# EAGLE design Adafruit HaD Proto HAT rev A (EAGLE 7.6.0)
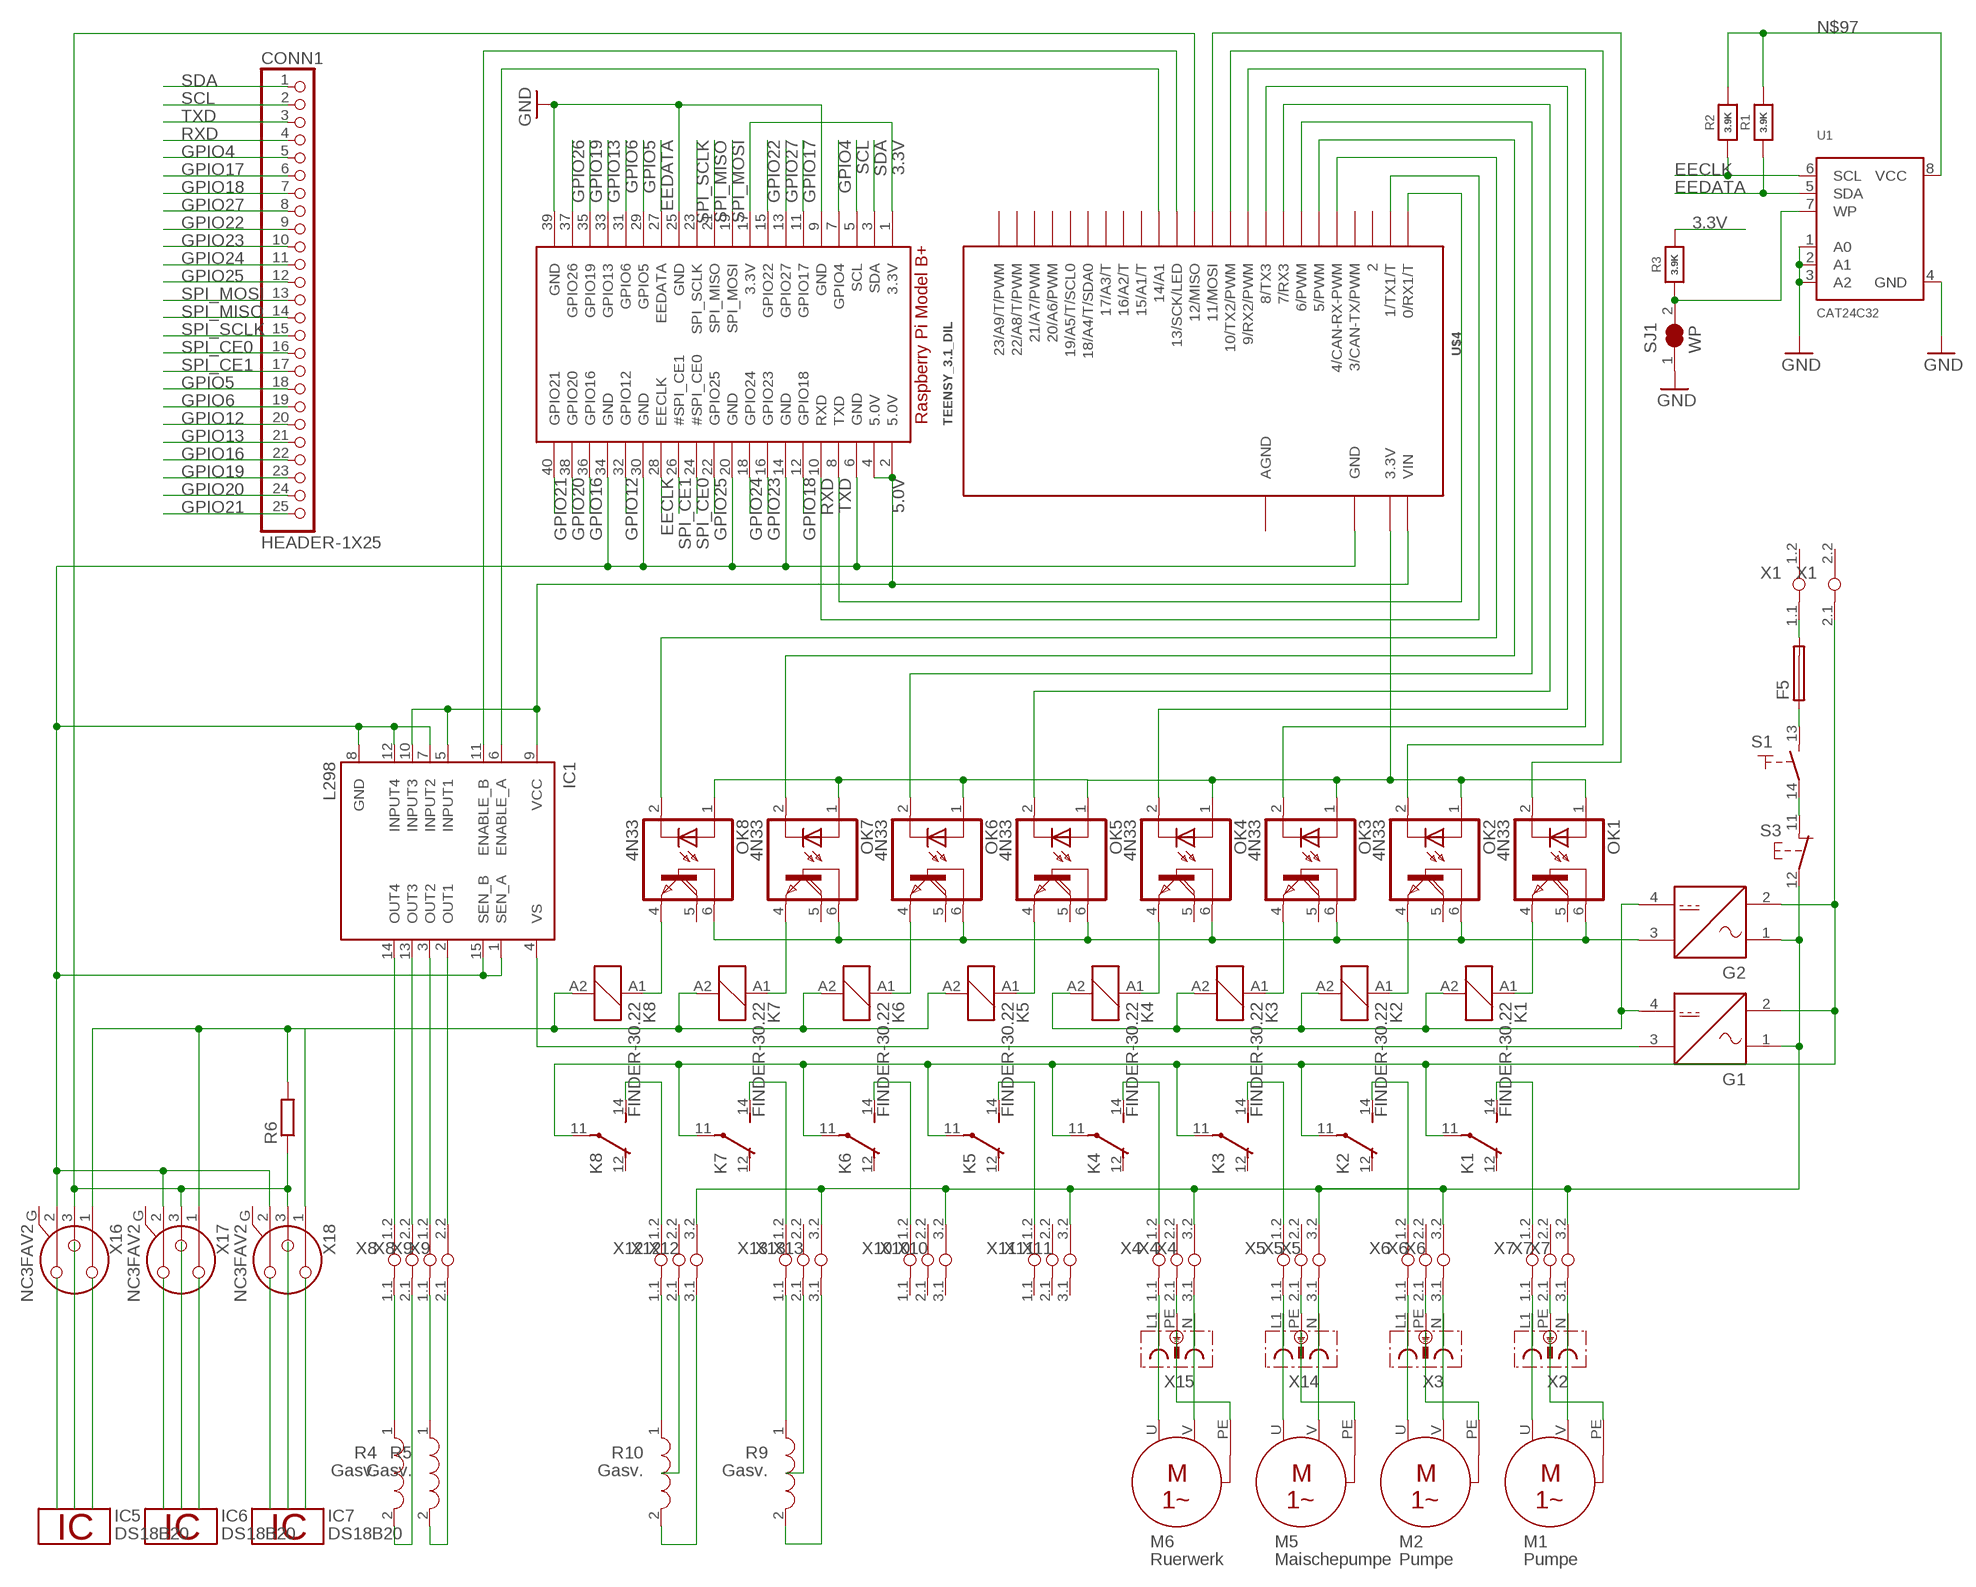
[diagram p0: schematic, sheet 1]

## Parts
CONN1  HEADER-1X25  [1X25_ROUND_70MIL]
F5  KS9V  [KS9V]
G1  NETZTEIL_GLEICHSPANNUNG  [NETZTEIL_GLEICHSPANNUNG]
G2  NETZTEIL_GLEICHSPANNUNG  [NETZTEIL_GLEICHSPANNUNG]
IC1  L298  [MULTIWATT-15]
IC5  DS18B20  [TO92-]
IC6  DS18B20  [TO92-]
IC7  DS18B20  [TO92-]
K1  FINDER-30.22  [FINDER-30.22]
K2  FINDER-30.22  [FINDER-30.22]
K3  FINDER-30.22  [FINDER-30.22]
K4  FINDER-30.22  [FINDER-30.22]
K5  FINDER-30.22  [FINDER-30.22]
K6  FINDER-30.22  [FINDER-30.22]
K7  FINDER-30.22  [FINDER-30.22]
K8  FINDER-30.22  [FINDER-30.22]
M1  Pumpe  MOTOR_1-PHASEN  [MOTOR_1-PHASEN]
M2  Pumpe  MOTOR_1-PHASEN  [MOTOR_1-PHASEN]
M5  Maischepumpe  MOTOR_1-PHASEN  [MOTOR_1-PHASEN]
M6  Ruerwerk  MOTOR_1-PHASEN  [MOTOR_1-PHASEN]
OK1  4N33  [DIL06]
OK2  4N33  [DIL06]
OK3  4N33  [DIL06]
OK4  4N33  [DIL06]
OK5  4N33  [DIL06]
OK6  4N33  [DIL06]
OK7  4N33  [DIL06]
OK8  4N33  [DIL06]
R1  3.9K  RESISTOR0805_NOOUTLINE  [0805-NO]
R2  3.9K  RESISTOR0805_NOOUTLINE  [0805-NO]
R3  3.9K  RESISTOR0805_NOOUTLINE  [0805-NO]
R4  Gasv.  SPULE_ALTERNATIV  [SPULE]
R5  Gasv.  SPULE_ALTERNATIV  [SPULE]
R6  R-EU_0204/2V  [0204V]
R9  Gasv.  SPULE_ALTERNATIV  [SPULE]
R10  Gasv.  SPULE_ALTERNATIV  [SPULE]
RPI1  RASPBERRYPI_BPLUS_HATNOSLOTS  [PI_HAT_NOSLOTS]
S1  SCHLIESSER_KIPPSCHALTER  [SCHLIESSER_KIPPSCHALTER]
S3  TASTER_OEFFNER  [AUSTASTER]
SJ1  WP  SOLDERJUMPER_CLOSED  [SOLDERJUMPER_CLOSEDWIRE]
U1  CAT24C32  EEPROM_I2C_SOIC8_GENERIC  [SOIC8_150MIL]
U$4  TEENSY_3.1_DIL  [TEENSY3-DIL]
X1  KLEMME_1-2  [KLEMME_1-2]
X2  STECKDOSE  [STECKDOSE]
X3  STECKDOSE  [STECKDOSE]
X4  KLEMME_1-3  [KLEMME_1-3]
X5  KLEMME_1-3  [KLEMME_1-3]
X6  KLEMME_1-3  [KLEMME_1-3]
X7  KLEMME_1-3  [KLEMME_1-3]
X8  KLEMME_1-2  [KLEMME_1-2]
X9  KLEMME_1-2  [KLEMME_1-2]
X10  KLEMME_1-3  [KLEMME_1-3]
X11  KLEMME_1-3  [KLEMME_1-3]
X12  KLEMME_1-3  [KLEMME_1-3]
X13  KLEMME_1-3  [KLEMME_1-3]
X14  STECKDOSE  [STECKDOSE]
X15  STECKDOSE  [STECKDOSE]
X16  NC3FAV2  [NC3FAV2]
X17  NC3FAV2  [NC3FAV2]
X18  NC3FAV2  [NC3FAV2]

## Nets
3.3V: R3.2 RPI1.1(3.3V) RPI1.17(3.3V)
5.0V: IC1.5(INPUT1) IC1.9(VCC) IC1.10(INPUT3) RPI1.2(5.0V) RPI1.4(5.0V) U$4.VIN
EECLK: R2.1 RPI1.28(EECLK) U1.6(SCL)
EEDATA: R1.1 RPI1.27(EEDATA) U1.5(SDA)
GND: IC1.1(SEN_A) IC1.7(INPUT2) IC1.8(GND) IC1.12(INPUT4) IC1.15(SEN_B) RPI1.6(GND) RPI1.9(GND) RPI1.14(GND) RPI1.20(GND) RPI1.25(GND) RPI1.30(GND) RPI1.34(GND) RPI1.39(GND) SJ1.1 U1.1(A0) U1.2(A1) U1.3(A2) U1.4(GND) U$4.GND X16.2 X17.2 X18.2
GPIO4: CONN1.5 RPI1.7(GPIO4)
GPIO5: CONN1.18 RPI1.29(GPIO5)
GPIO6: CONN1.19 RPI1.31(GPIO6)
GPIO12: CONN1.20 RPI1.32(GPIO12)
GPIO13: CONN1.21 RPI1.33(GPIO13)
GPIO16: CONN1.22 RPI1.36(GPIO16)
GPIO17: CONN1.6 RPI1.11(GPIO17)
GPIO18: CONN1.7 RPI1.12(GPIO18)
GPIO19: CONN1.23 RPI1.35(GPIO19)
GPIO20: CONN1.24 RPI1.38(GPIO20)
GPIO21: CONN1.25 RPI1.40(GPIO21)
GPIO22: CONN1.9 RPI1.15(GPIO22)
GPIO23: CONN1.10 RPI1.16(GPIO23)
GPIO24: CONN1.11 RPI1.18(GPIO24)
GPIO25: CONN1.12 RPI1.22(GPIO25)
GPIO26: RPI1.37(GPIO26)
GPIO27: CONN1.8 RPI1.13(GPIO27)
N$16: R3.1 SJ1.2 U1.7(WP)
N$24: IC1.11(ENABLE_B) U$4.13(13/SCK/LED)
N$25: IC1.6(ENABLE_A) U$4.14/A0(14/A1)
N$26: IC1.14(OUT4) X8.1.2(1:1.2)
N$27: G1.3 IC1.4(VS)
N$28: G1.1 G1.2 G2.1 G2.2 S3.12 X1.2.1(2:2.1) X4.3.2(3:3.2) X5.3.2(3:3.2) X6.3.2(3:3.2) X7.3.2(3:3.2) X10.3.2(3:3.2) X11.3.2(3:3.2) X12.3.2(3:3.2) X13.3.2(3:3.2)
N$29: R4.2 X8.2.1(2:2.1)
N$30: IC1.3(OUT2) X9.1.2(1:1.2)
N$31: IC1.2(OUT1) X9.2.2(2:2.2)
N$32: IC1.13(OUT3) X8.2.2(2:2.2)
N$33: OK4.2(C) U$4.8(8/TX3)
N$34: OK3.2(C) U$4.9(9/RX2/PWM)
N$35: OK2.2(C) U$4.10(10/TX2/PWM)
N$36: OK1.2(C) U$4.11(11/MOSI)
N$37: G2.3 OK1.6(B) OK2.6(B) OK3.6(B) OK4.6(B) OK5.6(B) OK6.6(B) OK7.6(B) OK8.6(B)
N$38: K1.A1 OK1.4(E)
N$40: K2.A1 OK2.4(E)
N$63: K3.A1 OK3.4(E)
N$64: K4.A1 OK4.4(E)
N$65: M1.U X2.L1 X7.1.1(1:1.1)
N$66: M2.U X3.L1 X6.1.1(1:1.1)
N$67: K3.14(-1:S) X5.1.2(1:1.2)
N$68: K4.14(-1:S) X4.1.2(1:1.2)
N$69: M5.U X5.1.1(1:1.1) X14.L1
N$70: M1.PE
N$71: M2.PE
N$72: M6.U X4.1.1(1:1.1) X15.L1
N$73: M5.PE
N$74: M6.PE
N$75: K2.14(-1:S) X6.1.2(1:1.2)
N$76: M2.V X3.N X6.3.1(3:3.1)
N$77: K1.14(-1:S) X7.1.2(1:1.2)
N$78: M1.V X2.N X7.3.1(3:3.1)
N$79: X3.PE X6.2.1(2:2.1)
N$80: X2.PE X7.2.1(2:2.1)
N$81: M6.V X4.3.1(3:3.1) X15.N
N$82: M5.V X5.3.1(3:3.1) X14.N
N$83: K1.11(-1:P)
N$84: K2.11(-1:P)
N$85: K3.11(-1:P)
N$86: K4.11(-1:P)
N$87: R4.1 X8.1.1(1:1.1)
N$88: F5.2 X1.1.1(1:1.1)
N$89: F5.1 S1.13
N$90: S1.14 S3.11
N$91: R6.1 U$4.12(12/MISO) X16.3 X17.3 X18.3
N$92: G1.4 G2.4 K1.A2 K2.A2 K3.A2 K4.A2
N$93: OK8.2(C) U$4.4(4/CAN-RX-PWM)
N$94: OK7.2(C) U$4.5(5/PWM)
N$95: OK6.2(C) U$4.6(6/PWM)
N$96: OK5.2(C) U$4.7(7/RX3)
N$97: R1.2 R2.2 U1.8(VCC)
N$98: K5.A1 OK5.4(E)
N$99: K6.A1 OK6.4(E)
N$100: K7.A1 OK7.4(E)
N$101: K8.A1 OK8.4(E)
N$102: R5.1 X9.1.1(1:1.1)
N$103: R5.2 X9.2.1(2:2.1)
N$104: K7.14(-1:S) X13.1.2(1:1.2)
N$105: K8.14(-1:S) X12.1.2(1:1.2)
N$106: K5.A2 K6.A2 K7.A2 K8.A2 R6.2 X16.1 X17.1 X18.1
N$108: R9.1 X13.1.1(1:1.1)
N$109: R9.2 X13.3.1(3:3.1)
N$110: R10.2 X12.3.1(3:3.1)
N$111: R10.1 X12.1.1(1:1.1)
N$112: K6.14(-1:S) X10.1.2(1:1.2)
N$114: K5.14(-1:S) X11.1.2(1:1.2)
N$118: X13.2.1(2:2.1)
N$119: X12.2.1(2:2.1)
N$120: K5.11(-1:P)
N$121: K6.11(-1:P)
N$122: K7.11(-1:P)
N$123: K8.11(-1:P)
N$125: X4.2.1(2:2.1) X15.PE
N$126: X5.2.1(2:2.1) X14.PE
N$132: OK1.1(A) OK2.1(A) OK3.1(A) OK4.1(A) OK5.1(A) OK6.1(A) OK7.1(A) OK8.1(A) U$4.3.3V
RXD: CONN1.4 RPI1.10(RXD) U$4.1(1/TX1/T)
SCL: CONN1.2 RPI1.5(SCL)
SDA: CONN1.1 RPI1.3(SDA)
SPI_CE0: CONN1.16 RPI1.24(#SPI_CE0)
SPI_CE1: CONN1.17 RPI1.26(#SPI_CE1)
SPI_MISO: CONN1.14 RPI1.21(SPI_MISO)
SPI_MOSI: CONN1.13 RPI1.19(SPI_MOSI)
SPI_SCLK: CONN1.15 RPI1.23(SPI_SCLK)
TXD: CONN1.3 RPI1.8(TXD) U$4.0(0/RX1/T)
Unconnected: K1.12(-1:O) K1.21(-2:P) K1.22(-2:O) K1.24(-2:S) K2.12(-1:O) K2.21(-2:P) K2.22(-2:O) K2.24(-2:S) K3.12(-1:O) K3.21(-2:P) K3.22(-2:O) K3.24(-2:S) K4.12(-1:O) K4.21(-2:P) K4.22(-2:O) K4.24(-2:S) K5.12(-1:O) K5.21(-2:P) K5.22(-2:O) K5.24(-2:S) K6.12(-1:O) K6.21(-2:P) K6.22(-2:O) K6.24(-2:S) K7.12(-1:O) K7.21(-2:P) K7.22(-2:O) K7.24(-2:S) K8.12(-1:O) K8.21(-2:P) K8.22(-2:O) K8.24(-2:S) OK1.5(COL) OK2.5(COL) OK3.5(COL) OK4.5(COL) OK5.5(COL) OK6.5(COL) OK7.5(COL) OK8.5(COL) U$4.2 U$4.3(3/CAN-TX/PWM) U$4.15/A1(15/A1/T) U$4.16/A2(16/A2/T) U$4.17/A3(17/A3/T) U$4.18/A4(18/A4/T/SDA0) U$4.19/A5(19/A5/T/SCL0) U$4.20/A6(20/A6/PWM) U$4.21/A7(21/A7/PWM) U$4.22/A8(22/A8/T/PWM) U$4.23/A9(23/A9/T/PWM) X1.1.2(1:1.2) X1.2.2(2:2.2) X4.2.2(2:2.2) X5.2.2(2:2.2) X6.2.2(2:2.2) X7.2.2(2:2.2) X10.1.1(1:1.1) X10.2.1(2:2.1) X10.2.2(2:2.2) X10.3.1(3:3.1) X11.1.1(1:1.1) X11.2.1(2:2.1) X11.2.2(2:2.2) X11.3.1(3:3.1) X12.2.2(2:2.2) X13.2.2(2:2.2) X16.G X17.G X18.G

## Power pins joined to a net without a drawn wire
1W: IC5.2 IC6.2 IC7.2
AGND: U$4.AGND
GND: IC5.1 IC6.1 IC7.1
VDD: IC5.3 IC6.3 IC7.3

## Library data of the parts
CONN1 = microbuilder:HEADER-1X25
F5 = fuse:KS9V: FUSE HOLDER CS, Schukat; OC_FARNELL: unknown; OC_NEWARK: unknown
G1 G2 = e-stromversorgungselemente:NETZTEIL_GLEICHSPANNUNG: Netzteil, Gleichspannung
IC1 = st-microelectronics:L298: DUAL FULL-BRIDGE DRIVER; MPN: L298N; OC_FARNELL: 1589425; OC_NEWARK: 32M1527
IC5-IC7 = 1wire:DS18B20: Programmable Resolution Digital Thermometer This chip provides a onewire thermosensor with approx. 0.5°C accuracy. A programmable over/undertemperure alarm is available. The precision can be set from 9..12 bits. Notes: Vdd must be applied for accurate measurements at low temperatures, as the parasite power circuit otherwise heats the sensor. If parasite power is used, Vdd has to be connected to GND. The DS1822 is a low-cost thermometer chip, the DS18S20 is similar to the DS18B20, but with 9 Bit precision only. Author: Jan Kandziora <jjj@gmx.de>
K1-K8 = relay:FINDER-30.22: SUBMINIATURE DIL-RELAIS FINDER 30.22.9.024.0000 Kontakt max. AC - 125V Distributor: Farnell Bestell Nr.: 1217371 Source: http://www.farnell.com/datasheets/87634.pdf; OC_FARNELL: unknown; OC_NEWARK: unknown
M1 M2 M5 M6 = e-motoren:MOTOR_1-PHASEN: 1-Phasen-Wechselstrom-Motor
OK1-OK8 = optocoupler:4N33: MOTOROLA OPTO COUPLER; MF: VISHAY/TELEFUNKEN; MPN: 4N33; OC_FARNELL: 1469601; OC_NEWARK: 88K1390
R1-R3 = microbuilder:RESISTOR: Resistors For new designs, use the packages preceded by an '_' character since they are more reliable: The following footprints should be used on most boards: _0402 - Standard footprint for regular board layouts _0603 - Standard footprint for regular board layouts _0805 - Standard footprint for regular board layouts _1206 - Standard footprint for regular board layouts For extremely tight-pitch boards where space is at a premium, the following 'micro-pitch' footprints can be used (smaller pads, no silkscreen outline, etc.): _0402MP - Micro-pitch footprint for very dense/compact boards _0603MP - Micro-pitch footprint for very dense/compact boards _0805MP - Micro-pitch footprint for very dense/compact boards _1206MP - Micro-pitch footprint for very dense/compact boards
R4 R5 R9 R10 = e-spulen-transformatoren:SPULE_ALTERNATIV: Spule alternativ
R6 = rcl:R-EU_: RESISTOR, European symbol
RPI1 = microbuilder:RASPBERRYPI_BPLUS
S1 = e-schalter:SCHLIESSER_KIPPSCHALTER: Kippschalter, Schließer
S3 = e-schalter:TASTER_OEFFNER: Austaster (Ruhekontakt)
SJ1 = microbuilder:SOLDERJUMPER_CLOSED: Solder Jumper - Closed These solder jumpers are closed by default CLOSEDWIRE - 10 mil trace between pads that can be cut and resoldered later CLOSEDPERM - 63 mil trace between pads for a permanent connection (used to 'bridge' two signals, a shameless hack for Eagle). Can double as a test point as well (no cream layer)
U1 = microbuilder:EEPROM_I2C_SOIC8_GENERIC: Note: The same pinout is used for many I2C EEPROMs in SOIC8(150mil) from a variety of manufacturers and in various sizes. Examples: 16K (2K x 8 Bit) I2C EEPROM 1.7-5.5V, 400KHz, -40°C-85°C Digikey: CAT24C16WI-GT3CT-ND 256K (32K x 8 Bit) I2C EEPROM 1.7-5.5V, 400KHz, -40°C-85°C Digikey: 24AA256-I/SN-ND
U$4 = Teensy_3_and_LC_Series_Boards_v1.1:TEENSY_3.1_DIL: Teensy 3.1 or 3.2 in a DIL Layout.
X1 X8 X9 = e-klemmen:KLEMME_1-2: Klemme 2 Pol.
X2 X3 X14 X15 = e-steckverbinder:STECKDOSE: Steckdose mit Schutzleiter
X4-X7 X10-X13 = e-klemmen:KLEMME_1-3: Klemme 3 Pol.
X16-X18 = con-neutrik_ag:NC3: Neutrik Audio Connector XLR SERIES Stereo 1/4" jack Source: www.neutrik.com/; MF: NEUTRIK; MPN: NC3FAV2; OC_FARNELL: unknown; OC_NEWARK: 83F7211

## Board
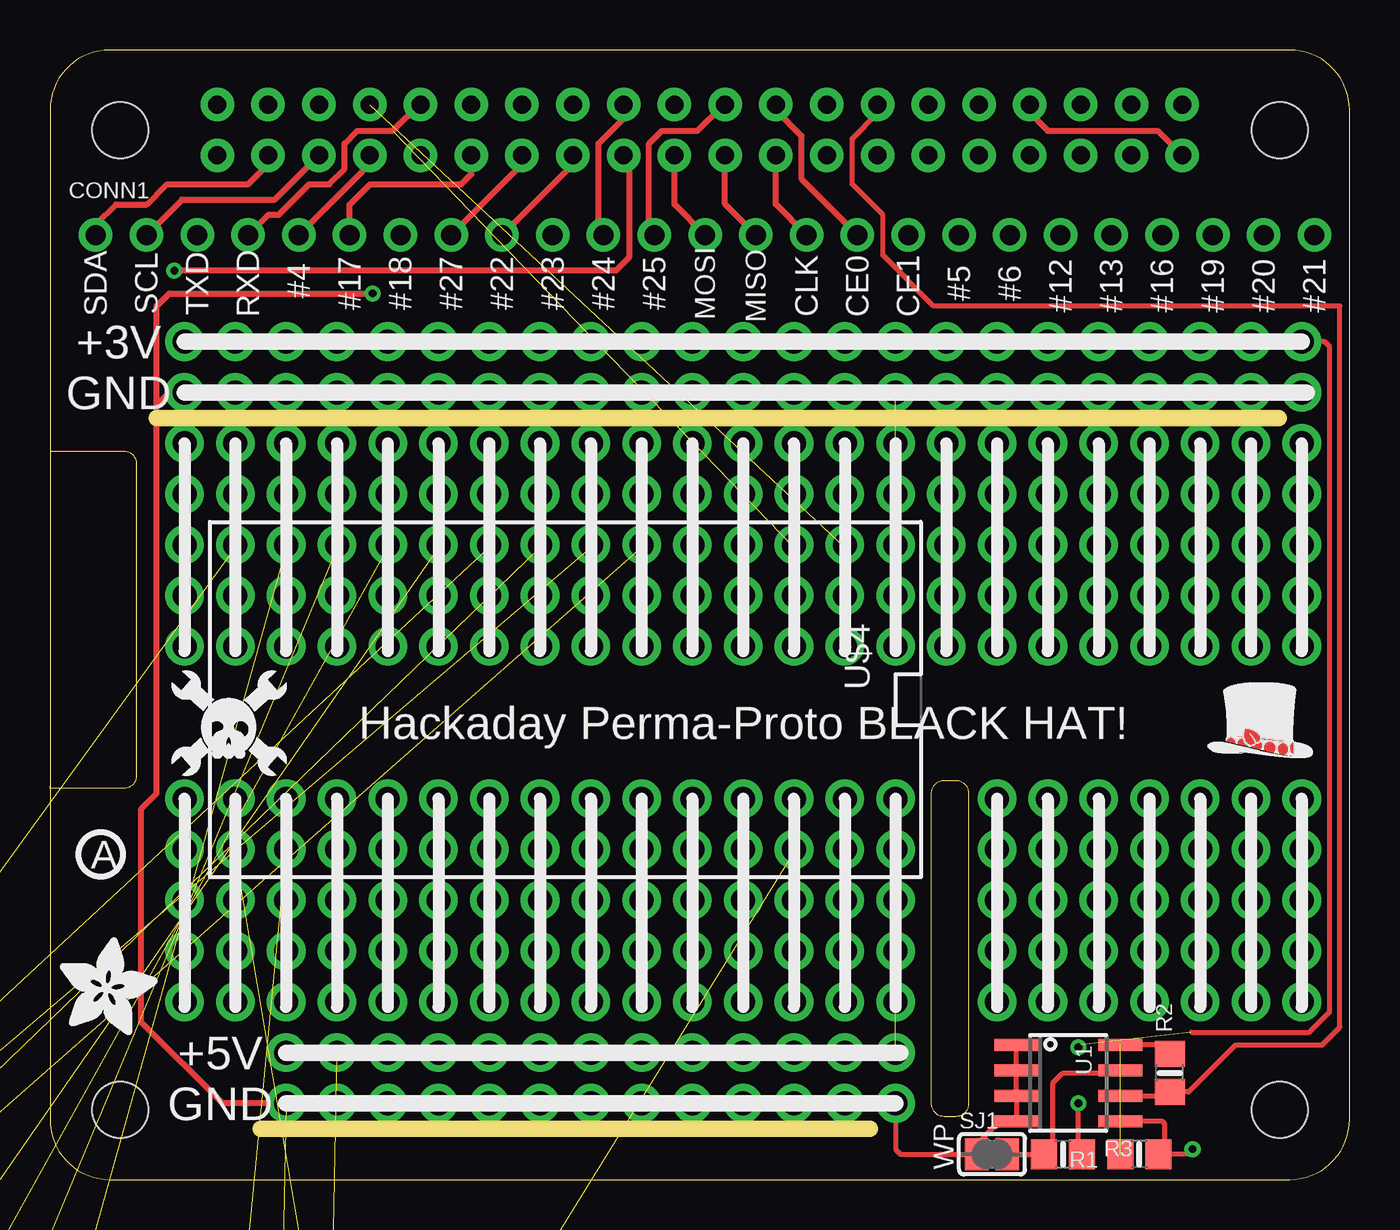
[diagram p1: board, top side]
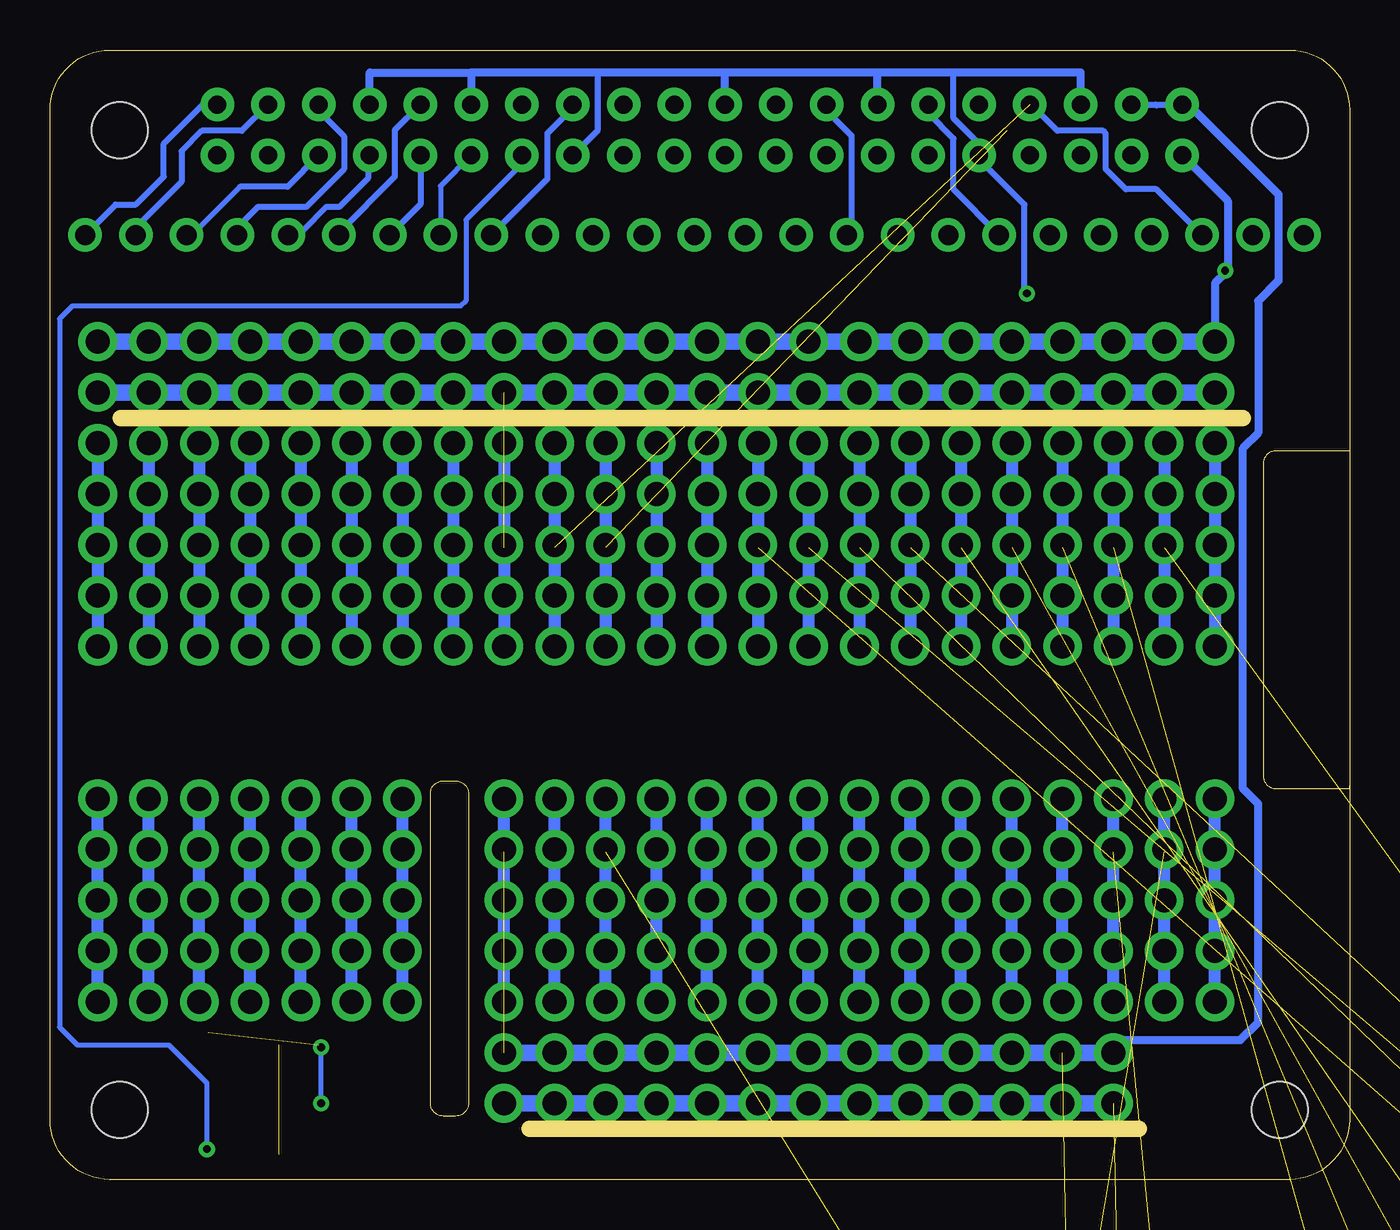
[diagram p2: board, bottom side, seen from below]

Size 65 x 56.5 mm. Coordinates in mm from the lower left corner, seen from the top.
Outline: 0,36.45 3.68,36.45 arc-90 4.32,35.81 4.32,20.19 arc-90 3.68,19.56 0,19.56 0,19.68
Outline: 44.7,3.18 45.34,3.18 arc90 45.97,3.81 45.97,19.3 arc90 45.34,19.94 44.7,19.94 arc90 44.07,19.3 44.07,3.81 arc90 44.7,3.18
Copper layers (1*16): Top 0.035mm / dielectric 1.5mm / Bottom 0.035mm
Design rules "adafruit *": minimum track width 8mil, minimum drill 15.5mil, track to track 8mil, track to pad 8mil, pad to pad 8mil, via to via 8mil, smd to smd 8mil, copper to edge 10mil, drill to drill 8mil, minimum pad ring 10mil, minimum via ring 8mil, stop-mask expansion 2mil, vias tented up to drill 20mil, thermal gap 10mil
Milling: 2 lines

### Footprints (pad centres in the part's own frame; a part is rotated, then mirrored left to right if it is on the bottom)
1X25_ROUND_70MIL = drill 1 pad 1.676: 1 -30.48,0; 2 -27.94,0; 3 -25.4,0; 4 -22.86,0; 5 -20.32,0; 6 -17.78,0; 7 -15.24,0; 8 -12.7,0; 9 -10.16,0; 10 -7.62,0; 11 -5.08,0; 12 -2.54,0; 13 0,0; 14 2.54,0; 15 5.08,0; 16 7.62,0; 17 10.16,0; 18 12.7,0; 19 15.24,0; 20 17.78,0; 21 20.32,0; 22 22.86,0; 23 25.4,0; 24 27.94,0; 25 30.48,0
KS9V = drill 1.321 pad 2.54 long: 1 0,3.81; 2 0,-3.81
NETZTEIL_GLEICHSPANNUNG = drill 0.5 pad 1 square: 1 -10.16,-5.08; 2 -10.16,-10.16; 3 10.16,-5.08; 4 10.16,-10.16
MULTIWATT-15 = drill 1.2 long: 1 -8.89,-7.62; 2 -7.62,-2.54; 3 -6.35,-7.62; 4 -5.08,-2.54; 5 -3.81,-7.62; 6 -2.54,-2.54; 7 -1.27,-7.62; 8 0,-2.54; 9 1.27,-7.62; 10 2.54,-2.54; 11 3.81,-7.62; 12 5.08,-2.54; 13 6.35,-7.62; 14 7.62,-2.54; 15 8.89,-7.62
TO92- = drill 0.813 octagon: 1 -2.54,0; 2 0,0; 3 2.54,0
FINDER-30.22 = drill 1 pad 1.6: 11 -1.27,-3.81; 12 3.81,-3.81; 14 8.89,-3.81; 21 -1.27,3.81; 22 3.81,3.81; 24 8.89,3.81; A1 -8.89,-3.81; A2 -8.89,3.81
MOTOR_1-PHASEN = drill 0.8 square: PE 2.54,3.175; U -2.54,3.175; V 0,3.175
DIL06 = drill 0.813 offset: 1 -2.54,-3.81; 2 0,-3.81; 3 2.54,-3.81; 4 2.54,3.81; 5 0,3.81; 6 -2.54,3.81
0805-NO = smd 1.3 x 1.5: 1 -0.95,0; 2 0.95,0
SPULE = drill 0.2 pad 0.6 square: 1 0,2.54; 2 0,-2.54
0204V = drill 0.813 octagon: 1 -1.27,0; 2 1.27,0
PI_HAT_NOSLOTS = drill 0.9 pad 1.676: 1 8.37,51.23; 2 8.37,53.77; 3 10.91,51.23; 4 10.91,53.77; 5 13.45,51.23; 6 13.45,53.77; 7 15.99,51.23; 8 15.99,53.77; 9 18.53,51.23; 10 18.53,53.77; 11 21.07,51.23; 12 21.07,53.77; 13 23.61,51.23; 14 23.61,53.77; 15 26.15,51.23; 16 26.15,53.77; 17 28.69,51.23; 18 28.69,53.77; 19 31.23,51.23; 20 31.23,53.77; 21 33.77,51.23; 22 33.77,53.77; 23 36.31,51.23; 24 36.31,53.77; 25 38.85,51.23; 26 38.85,53.77; 27 41.39,51.23; 28 41.39,53.77; 29 43.93,51.23; 30 43.93,53.77; 31 46.47,51.23; 32 46.47,53.77; 33 49.01,51.23; 34 49.01,53.77; 35 51.55,51.23; 36 51.55,53.77; 37 54.09,51.23; 38 54.09,53.77; 39 56.63,51.23; 40 56.63,53.77 | hole 2.8: 3.5,3.5; 3.5,52.5; 61.5,52.5; 61.5,3.5
SCHLIESSER_KIPPSCHALTER = drill 0.2 pad 0.6 square: 13 0,5.08; 14 0,-5.08
AUSTASTER = drill 0.2 pad 0.6 square: 11 0,7.62; 12 0,-7.62
SOLDERJUMPER_CLOSEDWIRE = smd 1.168 x 1.6: 1 -0.762,0; 2 0.762,0 | smd 0.635 x 0.203: WIRE 0,0
SOIC8_150MIL = smd 0.6 x 2.2: 1 -1.905,-2.6; 2 -0.635,-2.6; 3 0.635,-2.6; 4 1.905,-2.6; 5 1.905,2.6; 6 0.635,2.6; 7 -0.635,2.6; 8 -1.905,2.6
TEENSY3-DIL = drill 0.965: 0 -7.62,13.97; 1 -7.62,11.43; 2 -7.62,8.89; 3 -7.62,6.35; 3.3V 7.62,11.43; 4 -7.62,3.81; 5 -7.62,1.27; 6 -7.62,-1.27; 7 -7.62,-3.81; 8 -7.62,-6.35; 9 -7.62,-8.89; 10 -7.62,-11.43; 11 -7.62,-13.97; 12 -7.62,-16.51; 13 7.62,-16.51; 14/A0 7.62,-13.97; 15/A1 7.62,-11.43; 16/A2 7.62,-8.89; 17/A3 7.62,-6.35; 18/A4 7.62,-3.81; 19/A5 7.62,-1.27; 20/A6 7.62,1.27; 21/A7 7.62,3.81; 22/A8 7.62,6.35; 23/A9 7.62,8.89; AGND 7.62,13.97; GND -7.62,16.51; VIN 7.62,16.51
KLEMME_1-2 = drill 0.5 pad 1 square: 1.1 0,-12.7; 1.2 0,-2.54; 2.1 2.54,-12.7; 2.2 2.54,-2.54
STECKDOSE = drill 0.8 square: L1 -2.54,0; N 2.54,0; PE 0,-1.27
KLEMME_1-3 = drill 0.5 pad 1 square: 1.1 0,-12.7; 1.2 0,-2.54; 2.1 2.54,-12.7; 2.2 2.54,-2.54; 3.1 5.08,-12.7; 3.2 5.08,-2.54
NC3FAV2 = drill 1.6: 1 3.81,0; 2 -3.81,0 | drill 1.2: 3 0,-4.45; G 8.25,-10.16

### Placement (x,y rotation side)
CONN1  32.77,47.24 0 top
F5  -186.69,-123.19 0 top  (outside the outline)
G1  11.43,-21.59 0 top  (outside the outline)
G2  11.43,-29.21 0 top  (outside the outline)
IC1  11.43,-11.43 0 top  (outside the outline)
IC5  -209.55,-240.03 0 top  (outside the outline)
IC6  -209.55,-250.19 0 top  (outside the outline)
IC7  -209.55,-260.35 0 top  (outside the outline)
K1  1.27,-46.99 0 top  (outside the outline)
K2  1.27,-57.15 0 top  (outside the outline)
K3  1.27,-67.31 0 top  (outside the outline)
K4  1.27,-77.47 0 top  (outside the outline)
K5  -199.39,-176.53 0 top  (outside the outline)
K6  -176.53,-176.53 0 top  (outside the outline)
K7  -199.39,-186.69 0 top  (outside the outline)
K8  -176.53,-186.69 0 top  (outside the outline)
M1  -57.15,-107.95 0 top  (outside the outline)
M2  -57.15,-120.65 0 top  (outside the outline)
M5  -207.01,-207.01 0 top  (outside the outline)
M6  -207.01,-219.71 0 top  (outside the outline)
OK1  -19.05,-74.93 0 top  (outside the outline)
OK2  -31.75,-74.93 0 top  (outside the outline)
OK3  -44.45,-74.93 0 top  (outside the outline)
OK4  -57.15,-74.93 0 top  (outside the outline)
OK5  -176.53,-148.59 0 top  (outside the outline)
OK6  -166.37,-148.59 0 top  (outside the outline)
OK7  -207.01,-163.83 0 top  (outside the outline)
OK8  -196.85,-163.83 0 top  (outside the outline)
R1  54.48,1.27 180 top
R2  56.01,5.33 90 top
R3  50.67,1.27 0 top
R4  -3.81,-36.83 0 top  (outside the outline)
R5  -6.35,-36.83 0 top  (outside the outline)
R6  -199.39,-257.81 0 top  (outside the outline)
R9  -191.77,-196.85 0 top  (outside the outline)
R10  -189.23,-196.85 0 top  (outside the outline)
RPI1  0,0 0 top
S1  -201.93,-125.73 0 top  (outside the outline)
S3  -212.09,-130.81 0 top  (outside the outline)
SJ1  47.12,1.27 0 top
U1  50.93,4.83 270 top
U$1  [ADAFRUIT_5MM]  0.51,7.24 0 top
U$2  [PIHATLOGO]  57.91,21.08 0 top
U$3  [PCBFEAT-REV-056]  2.54,16.26 0 top
U$4  25.78,24 270 top
U$5  [HAD_LOGO_200MIL]  6.1,20.19 0 top
X1  -11.43,-26.67 0 top  (outside the outline)
X2  -57.15,-87.63 0 top  (outside the outline)
X3  -57.15,-97.79 0 top  (outside the outline)
X4  -100.33,-110.49 0 top  (outside the outline)
X5  -107.95,-110.49 0 top  (outside the outline)
X6  -85.09,-110.49 0 top  (outside the outline)
X7  -92.71,-110.49 0 top  (outside the outline)
X8  -217.17,-250.19 0 top  (outside the outline)
X9  -222.25,-250.19 0 top  (outside the outline)
X10  -212.09,-140.97 0 top  (outside the outline)
X11  -204.47,-140.97 0 top  (outside the outline)
X12  -196.85,-140.97 0 top  (outside the outline)
X13  -189.23,-140.97 0 top  (outside the outline)
X14  -196.85,-217.17 0 top  (outside the outline)
X15  -207.01,-229.87 0 top  (outside the outline)
X16  -237.49,-245.11 0 top  (outside the outline)
X17  -262.89,-245.11 0 top  (outside the outline)
X18  -288.29,-245.11 0 top  (outside the outline)

### Tracks (layer width: path | path; a pad name or v marks a point on that pad's centre or on a via)
1W  (2 unrouted)
3.3V  (via drill 0.39, 1.2 pad 1.93)  (1 unrouted)
  Top 0.254: R3.2 51.69,1.34 51.43,1.59 v51.43,3.81 | v51.43,6.6 51.56,6.73 | 57.09,7.37 62.99,7.37 64.01,8.38 64.01,41.66 63.75,41.91 v62.61,41.91
  Top 0.305: RPI1.17 28.96,50.96 28.96,46.1 28.32,45.47 v6.22,45.47
  Bottom 0.254: v51.43,3.81 v51.43,6.6
  Bottom 0.406: RPI1.1 6.1,48.96 6.1,45.47 6.22,45.34 | 6.22,45.34 6.73,44.83 v6.73,41.91 | v6.22,45.47 6.22,45.34
  Bottom 0.813: v6.73,41.91 v9.27,41.91 v11.81,41.91 v14.35,41.91 v16.89,41.91 v19.43,41.91 v21.97,41.91 v24.51,41.91 v27.05,41.91 v29.59,41.91 v32.13,41.91 v34.67,41.91 v37.21,41.91 v39.75,41.91 v42.29,41.91 v44.83,41.91 v47.37,41.91 v49.91,41.91 v52.45,41.91 v54.99,41.91 v57.53,41.91 v60.07,41.91 v62.61,41.91
5.0V  (via drill 1.2 pad 1.93)  (4 unrouted)
  Bottom 0.305: 11.18,6.35 v11.81,6.35 11.81,6.99 | RPI1.4 9.7,53.77 | 9.7,53.77 RPI1.2 | 9.7,53.77 9.65,53.72
  Bottom 0.406: 11.81,6.99 5.46,6.99 4.57,7.87 4.57,18.8 5.33,19.56 5.33,36.58 4.57,37.34 4.57,43.94 3.56,44.96 3.56,49.28 8.05,53.77 RPI1.2
  Bottom 0.813: v42.29,6.35 v39.75,6.35 v37.21,6.35 v34.67,6.35 v32.13,6.35 v29.59,6.35 v27.05,6.35 v24.51,6.35 v21.97,6.35 v19.43,6.35 v16.89,6.35 v14.35,6.35 v11.81,6.35
EECLK
  Top 0.254: U1.6 55.81,4.19 R2.1 56.96,4.38 59.31,6.73 63.63,6.73 64.52,7.62 64.52,43.69 44.2,43.69 41.66,46.23 41.66,48.26 40.13,49.78 40.13,52.07 41.39,53.33 RPI1.28
EEDATA  (via drill 0.39)
  Top 0.254: U1.5 55.63,2.92 55.75,2.79 55.75,1.59 R1.1 56.9,1.27 v57.15,1.52
  Bottom 0.254: RPI1.27 41.39,50.81 44.2,48.01 44.2,43.94 44.45,43.69 63.88,43.69 64.52,43.05 64.52,7.62 63.63,6.73 59.05,6.73 57.15,4.83 v57.15,1.52
GND  (via drill 0.39, 1.2 pad 1.93)  (12 unrouted)
  Top 0.254: U1.1 U1.2 U1.3 U1.4 47.5,2.92 46.1,1.52 SJ1.1 42.54,1.27 42.29,1.52 v42.29,3.81
  Top 0.305: RPI1.34 49.01,53.35 49.91,52.45 55.41,52.45 RPI1.39 | v11.81,3.81 8.64,3.81 4.57,7.87 4.57,18.54 5.33,19.3 5.33,38.73 | 5.33,38.73 5.97,39.37 v6.73,39.37 | 5.33,38.73 5.33,43.69 5.97,44.32 v16.13,44.32
  Bottom 0.305: 19.94,55.37 19.81,55.24 19.81,53.09 18.53,51.8 RPI1.9 18.53,51.04 16.26,48.77 16.26,44.45 v16.13,44.32 | RPI1.25 37.59,52.49 37.59,55.37
  Bottom 0.406: RPI1.34 49.01,55.37 43.94,55.37 | 43.94,55.37 43.94,53.77 RPI1.30 | RPI1.20 31.23,55.37 | 31.23,55.37 37.59,55.37 43.94,55.37 | RPI1.14 23.61,55.37 | 23.61,55.37 31.23,55.37 | RPI1.6 13.45,55.37 19.94,55.37 23.61,55.37
  Bottom 0.813: v62.61,39.37 v60.07,39.37 v57.53,39.37 v54.99,39.37 v52.45,39.37 v49.91,39.37 v47.37,39.37 v44.83,39.37 v42.29,39.37 v39.75,39.37 v37.21,39.37 v34.67,39.37 v32.13,39.37 v29.59,39.37 v27.05,39.37 v24.51,39.37 v21.97,39.37 v19.43,39.37 v16.89,39.37 v14.35,39.37 v11.81,39.37 v9.27,39.37 v6.73,39.37 | v11.81,3.81 v14.35,3.81 v16.89,3.81 v19.43,3.81 v21.97,3.81 v24.51,3.81 v27.05,3.81 v29.59,3.81 v32.13,3.81 v34.67,3.81 v37.21,3.81 v39.75,3.81 v42.29,3.81
GPIO4
  Top 0.305: CONN1.5 15.99,50.79 RPI1.7
GPIO5
  Bottom 0.254: RPI1.29 45.47,49.69 CONN1.18
GPIO6
  Bottom 0.305: RPI1.31 46.47,48.78 CONN1.19
GPIO12
  Bottom 0.305: RPI1.32 47.75,52.49 47.75,50.16 50.55,47.37 CONN1.20
GPIO13
  Bottom 0.305: RPI1.33 49.1,51.23 49.1,50.09 50.55,48.64 51.18,48.64 52.32,47.5 52.83,47.5 CONN1.21
GPIO16
  Bottom 0.305: RPI1.36 51.55,53.45 50.29,52.2 50.29,50.55 52.2,48.64 54.61,48.64 55.63,47.62 CONN1.22
GPIO17
  Top 0.305: CONN1.6 14.99,48.77 16,49.78 20.57,49.78 21.07,50.28 RPI1.11
GPIO18
  Bottom 0.305: CONN1.7 19.81,49.53 19.81,52.07 21.07,53.33 RPI1.12
GPIO19
  Bottom 0.254: 55.5,49.66 57.91,47.24 CONN1.23
  Bottom 0.305: RPI1.35 53.12,49.66 55.5,49.66
GPIO20
  Bottom 0.305: RPI1.38 55.41,52.45 57.4,52.45 58.42,51.43 58.42,49.91 60.71,47.62 CONN1.24
GPIO21
  Bottom 0.305: CONN1.25 61.72,48.77 60.71,48.77 59.31,50.16 59.31,51.82 57.4,53.72 56.68,53.72 RPI1.40
GPIO22
  Top 0.305: CONN1.9 26.15,50.79 RPI1.15
GPIO23
  Bottom 0.305: CONN1.10 24.89,47.5 24.89,52.2 26.15,53.45 RPI1.16
GPIO24
  Top 0.305: CONN1.11 27.43,47.5 27.43,51.82 28.69,53.07 RPI1.18
GPIO25
  Top 0.305: CONN1.12 29.97,47.5 29.97,51.82 30.61,52.45 32.38,52.45 33.7,53.77 RPI1.22
GPIO27
  Top 0.305: CONN1.8 23.61,50.79 RPI1.13
N$1  (via drill 1.2 pad 1.93)
  Bottom 0.61: v6.73,19.05 v6.73,16.51 v6.73,13.97 v6.73,11.43 v6.73,8.89
N$2  (via drill 1.2 pad 1.93)
  Bottom 0.61: v9.27,8.89 v9.27,11.43 v9.27,13.97 v9.27,16.51 v9.27,19.05
N$3  (via drill 1.2 pad 1.93)
  Bottom 0.61: v11.81,19.05 v11.81,16.51 v11.81,13.97 v11.81,11.43 v11.81,8.89
N$4  (via drill 1.2 pad 1.93)
  Bottom 0.61: v14.35,8.89 v14.35,11.43 v14.35,13.97 v14.35,16.51 v14.35,19.05
N$5  (via drill 1.2 pad 1.93)
  Bottom 0.61: v16.89,19.05 v16.89,16.51 v16.89,13.97 v16.89,11.43 v16.89,8.89
N$6  (via drill 1.2 pad 1.93)
  Bottom 0.61: v19.43,8.89 v19.43,11.43 v19.43,13.97 v19.43,16.51 v19.43,19.05
N$7  (via drill 1.2 pad 1.93)
  Bottom 0.61: v24.51,8.89 v24.51,11.43 v24.51,13.97 v24.51,16.51 v24.51,19.05
N$8  (via drill 1.2 pad 1.93)
  Bottom 0.61: v21.97,19.05 v21.97,16.51 v21.97,13.97 v21.97,11.43 v21.97,8.89
N$9  (via drill 1.2 pad 1.93)
  Bottom 0.61: v27.05,19.05 v27.05,16.51 v27.05,13.97 v27.05,11.43 v27.05,8.89
N$10  (via drill 1.2 pad 1.93)
  Bottom 0.61: v29.59,19.05 v29.59,16.51 v29.59,13.97 v29.59,11.43 v29.59,8.89
N$11  (via drill 1.2 pad 1.93)
  Bottom 0.61: v32.13,19.05 v32.13,16.51 v32.13,13.97 v32.13,11.43 v32.13,8.89
N$12  (via drill 1.2 pad 1.93)
  Bottom 0.61: v34.67,8.89 v34.67,11.43 v34.67,13.97 v34.67,16.51 v34.67,19.05
N$13  (via drill 1.2 pad 1.93)
  Bottom 0.61: v37.21,19.05 v37.21,16.51 v37.21,13.97 v37.21,11.43 v37.21,8.89
N$14  (via drill 1.2 pad 1.93)
  Bottom 0.61: v39.75,8.89 v39.75,11.43 v39.75,13.97 v39.75,16.51 v39.75,19.05
N$15  (via drill 1.2 pad 1.93)
  Bottom 0.61: v42.29,8.89 v42.29,11.43 v42.29,13.97 v42.29,16.51 v42.29,19.05
N$16
  Top 0.254: SJ1.2 R3.1 50.16,1.71 50.16,4.83 50.67,5.33 53.4,5.33 U1.7
N$17  (via drill 1.2 pad 1.93)
  Bottom 0.61: v49.91,19.05 v49.91,16.51 v49.91,13.97 v49.91,11.43 v49.91,8.89
N$18  (via drill 1.2 pad 1.93)
  Bottom 0.61: v47.37,8.89 v47.37,11.43 v47.37,13.97 v47.37,16.51 v47.37,19.05
N$19  (via drill 1.2 pad 1.93)
  Bottom 0.61: v52.45,19.05 v52.45,16.51 v52.45,13.97 v52.45,11.43 v52.45,8.89
N$20  (via drill 1.2 pad 1.93)
  Bottom 0.61: v54.99,8.89 v54.99,11.43 v54.99,13.97 v54.99,16.51 v54.99,19.05
N$21  (via drill 1.2 pad 1.93)
  Bottom 0.61: v60.07,8.89 v60.07,11.43 v60.07,13.97 v60.07,16.51 v60.07,19.05
N$22  (via drill 1.2 pad 1.93)
  Bottom 0.61: v57.53,19.05 v57.53,16.51 v57.53,13.97 v57.53,11.43 v57.53,8.89
N$23  (via drill 1.2 pad 1.93)
  Bottom 0.61: v62.61,19.05 v62.61,16.51 v62.61,13.97 v62.61,11.43 v62.61,8.89
N$24  (1 unrouted)
N$25  (1 unrouted)
N$26  (1 unrouted)
N$27  (1 unrouted)
N$28  (13 unrouted)
N$29  (1 unrouted)
N$30  (1 unrouted)
N$31  (1 unrouted)
N$32  (1 unrouted)
N$33  (1 unrouted)
N$34  (1 unrouted)
N$35  (1 unrouted)
N$36  (1 unrouted)
N$37  (8 unrouted)
N$38  (1 unrouted)
N$39  (via drill 1.2 pad 1.93)
  Bottom 0.61: v62.61,36.83 v62.61,34.29 v62.61,31.75 v62.61,29.21 v62.61,26.67
N$40  (1 unrouted)
N$41  (via drill 1.2 pad 1.93)
  Bottom 0.61: v60.07,26.67 v60.07,29.21 v60.07,31.75 v60.07,34.29 v60.07,36.83
N$42  (via drill 1.2 pad 1.93)
  Bottom 0.61: v57.53,26.67 v57.53,29.21 v57.53,31.75 v57.53,34.29 v57.53,36.83
N$43  (via drill 1.2 pad 1.93)
  Bottom 0.61: v54.99,26.67 v54.99,29.21 v54.99,31.75 v54.99,34.29 v54.99,36.83
N$44  (via drill 1.2 pad 1.93)
  Bottom 0.61: v52.45,36.83 v52.45,34.29 v52.45,31.75 v52.45,29.21 v52.45,26.67
N$45  (via drill 1.2 pad 1.93)
  Bottom 0.61: v49.91,26.67 v49.91,29.21 v49.91,31.75 v49.91,34.29 v49.91,36.83
N$46  (via drill 1.2 pad 1.93)
  Bottom 0.61: v47.37,36.83 v47.37,34.29 v47.37,31.75 v47.37,29.21 v47.37,26.67
N$47  (via drill 1.2 pad 1.93)
  Bottom 0.61: v44.83,36.83 v44.83,34.29 v44.83,31.75 v44.83,29.21 v44.83,26.67
N$48  (via drill 1.2 pad 1.93)
  Bottom 0.61: v42.29,26.67 v42.29,29.21 v42.29,31.75 v42.29,34.29 v42.29,36.83
N$49  (via drill 1.2 pad 1.93)
  Bottom 0.61: v37.21,26.67 v37.21,29.21 v37.21,31.75 v37.21,34.29 v37.21,36.83
N$50  (via drill 1.2 pad 1.93)
  Bottom 0.61: v39.75,36.83 v39.75,34.29 v39.75,31.75 v39.75,29.21 v39.75,26.67
N$51  (via drill 1.2 pad 1.93)
  Bottom 0.61: v34.67,26.67 v34.67,29.21 v34.67,31.75 v34.67,34.29 v34.67,36.83
N$52  (via drill 1.2 pad 1.93)
  Bottom 0.61: v32.13,36.83 v32.13,34.29 v32.13,31.75 v32.13,29.21 v32.13,26.67
N$53  (via drill 1.2 pad 1.93)
  Bottom 0.61: v27.05,36.83 v27.05,34.29 v27.05,31.75 v27.05,29.21 v27.05,26.67
N$54  (via drill 1.2 pad 1.93)
  Bottom 0.61: v29.59,26.67 v29.59,29.21 v29.59,31.75 v29.59,34.29 v29.59,36.83
N$55  (via drill 1.2 pad 1.93)
  Bottom 0.61: v24.51,26.67 v24.51,29.21 v24.51,31.75 v24.51,34.29 v24.51,36.83
N$56  (via drill 1.2 pad 1.93)
  Bottom 0.61: v21.97,36.83 v21.97,34.29 v21.97,31.75 v21.97,29.21 v21.97,26.67
N$57  (via drill 1.2 pad 1.93)
  Bottom 0.61: v19.43,26.67 v19.43,29.21 v19.43,31.75 v19.43,34.29 v19.43,36.83
N$58  (via drill 1.2 pad 1.93)
  Bottom 0.61: v16.89,36.83 v16.89,34.29 v16.89,31.75 v16.89,29.21 v16.89,26.67
N$59  (via drill 1.2 pad 1.93)
  Bottom 0.61: v11.81,26.67 v11.81,29.21 v11.81,31.75 v11.81,34.29 v11.81,36.83
N$60  (via drill 1.2 pad 1.93)
  Bottom 0.61: v14.35,36.83 v14.35,34.29 v14.35,31.75 v14.35,29.21 v14.35,26.67
N$61  (via drill 1.2 pad 1.93)
  Bottom 0.61: v9.27,26.67 v9.27,29.21 v9.27,31.75 v9.27,34.29 v9.27,36.83
N$62  (via drill 1.2 pad 1.93)
  Bottom 0.61: v6.73,36.83 v6.73,34.29 v6.73,31.75 v6.73,29.21 v6.73,26.67
N$63  (1 unrouted)
N$64  (1 unrouted)
N$65  (2 unrouted)
N$66  (2 unrouted)
N$67  (1 unrouted)
N$68  (1 unrouted)
N$69  (2 unrouted)
N$72  (2 unrouted)
N$75  (1 unrouted)
N$76  (2 unrouted)
N$77  (1 unrouted)
N$78  (2 unrouted)
N$79  (1 unrouted)
N$80  (1 unrouted)
N$81  (2 unrouted)
N$82  (2 unrouted)
N$87  (1 unrouted)
N$88  (1 unrouted)
N$89  (1 unrouted)
N$90  (1 unrouted)
N$91  (4 unrouted)
N$92  (5 unrouted)
N$93  (1 unrouted)
N$94  (1 unrouted)
N$95  (1 unrouted)
N$96  (1 unrouted)
N$97  (1 unrouted)
  Top 0.254: R2.2 55.56,6.73 U1.8
N$98  (1 unrouted)
N$99  (1 unrouted)
N$100  (1 unrouted)
N$101  (1 unrouted)
N$102  (1 unrouted)
N$103  (1 unrouted)
N$104  (1 unrouted)
N$105  (1 unrouted)
N$106  (7 unrouted)
N$108  (1 unrouted)
N$109  (1 unrouted)
N$110  (1 unrouted)
N$111  (1 unrouted)
N$112  (1 unrouted)
N$114  (1 unrouted)
N$125  (1 unrouted)
N$126  (1 unrouted)
N$132  (8 unrouted)
RXD  (1 unrouted)
  Top 0.305: CONN1.4 10.92,48.26 11.43,48.26 12.95,49.78 13.97,49.78 14.73,50.55 14.73,51.82 15.37,52.45 17.14,52.45 18.46,53.77 RPI1.10
SCL
  Top 0.305: CONN1.2 6.6,49.02 11.24,49.02 RPI1.5
SDA
  Top 0.305: CONN1.1 2.29,47.75 3.3,48.77 4.83,48.77 5.84,49.78 9.91,49.78 10.91,50.79 RPI1.3
SPI_CE0
  Top 0.305: CONN1.16 37.59,50.04 37.59,52.2 36.31,53.48 RPI1.24
SPI_CE1
  Bottom 0.305: RPI1.26 38.85,53.61 40.13,52.32 40.13,50.04 CONN1.17
SPI_MISO
  Top 0.305: CONN1.14 33.77,48.78 RPI1.21
SPI_MOSI
  Top 0.305: CONN1.13 31.23,48.78 RPI1.19
SPI_SCLK
  Top 0.305: CONN1.15 36.31,48.78 RPI1.23
TXD  (1 unrouted)
  Bottom 0.305: CONN1.3 9.65,49.53 11.18,49.53 12.19,50.55 12.19,52.32 12.32,52.45 14.61,52.45 15.92,53.77 RPI1.8
VDD  (2 unrouted)

### Text on the board
tPlace: SDA | SCL | TXD | RXD | #4 | #17 | #18 | #27 | #22 | #23 | #24 | #25 | MOSI | MISO | CLK | CE0 | CE1 | #5 | #6 | #12 | #13 | #16 | #19 | #20 | #21 | +3V | GND | Hackaday Perma-Proto BLACK HAT! | +5V | GND | WP
tSilk: + | + | + | +